# Altium schematic sheet power.SchDoc
size A4 portrait
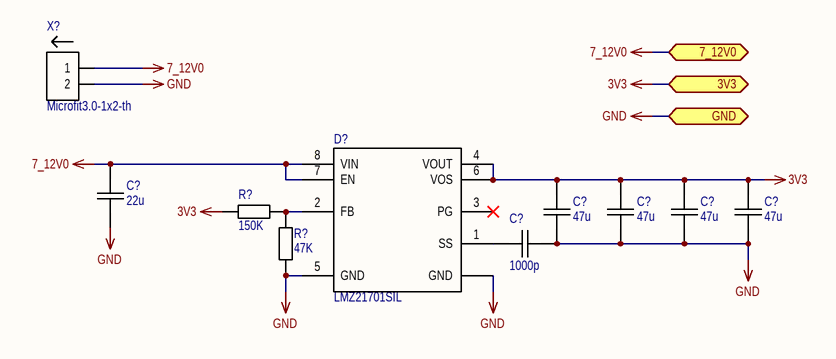
[diagram p0: power.SchDoc]

## Parts
(Parts that share a designator on the sheet are numbered #1, #2 ... from top to bottom, then left to right.)
C?#1  value 22u  [CAP-1206]  (hidden comment: CAP-22u-10%-25V-X7R-1206)
C?#2  value 47u  [CAP-0805]  (hidden comment: CAP-47u-20%-6.3V-X5R-0805)
C?#3  value 47u  [CAP-0805]  (hidden comment: CAP-47u-20%-6.3V-X5R-0805)
C?#4  value 47u  [CAP-0805]  (hidden comment: CAP-47u-20%-6.3V-X5R-0805)
C?#5  value 47u  [CAP-0805]  (hidden comment: CAP-47u-20%-6.3V-X5R-0805)
C?#6  value 1000p  [CAP-0402]  (hidden comment: CAP-1000p-5%-50V-NP0-0402)
D?  LMZ21701SIL  [uSIP_SIL0008E]
R?#1  value 150K  [RES-0402]  (hidden comment: RES-150K-1%-0.063-0402)
R?#2  value 47K  [RES-0402]  (hidden comment: RES-47K-1%-0.063-0402)
X?  Microfit3.0-1x2-th  [Microfit3.0-1x2-th]

## Ports
3V3 (bidir), 7_12V0 (bidir), GND (bidir)

## Nets
3V3: C?#2.1 C?#3.2 C?#4.2 C?#5.2 D?.4(VOUT) D?.6(VOS) R?#1.2 ; port 3V3
7_12V0: C?#1.2 D?.7(EN) D?.8(VIN) X?.1 ; port 7_12V0
GND: C?#1.1 C?#2.2 C?#3.1 C?#4.1 C?#5.1 C?#6.1 D?.5(GND) D?.PAD(GND) R?#2.2 X?.2 ; port GND
NetC?#6_2: C?#6.2 D?.1(SS)
NetD?_2: D?.2(FB) R?#1.1 R?#2.1

Not connected (* = marked no-connect by the designer): D? 3(PG)*

## Library data of the parts
C?#1 = CAP-1206: Конденсатор; Tolerance: 10; Voltage: 25; Part Number: *; Manufacturer: *; Temperature: X7R
C?#2-C?#5 = CAP-0805: Конденсатор; Tolerance: 20; Voltage: 6.3; Part Number: *; Manufacturer: *; Temperature: X5R
C?#6 = CAP-0402: Конденсатор; Tolerance: 5; Voltage: 50; Part Number: *; Manufacturer: *; Temperature: NP0
D? = LMZ21701: Интегральная микросхема; Manufacturer: TI; Part Number: LMZ21701SIL
R?#1 R?#2 = RES-0402: Резистор; Tolerance: 1; Power: 0.063; Part Number: *; Manufacturer: *
X? = Microfit3.0-1x2-th: Manufacturer: *; Part Number: Microfit3.0-1x2-th